# Altium schematic sheet Sheet1.SchDoc
size 209 x 297 mm; SheetNumber: 1; SheetTotal: 1
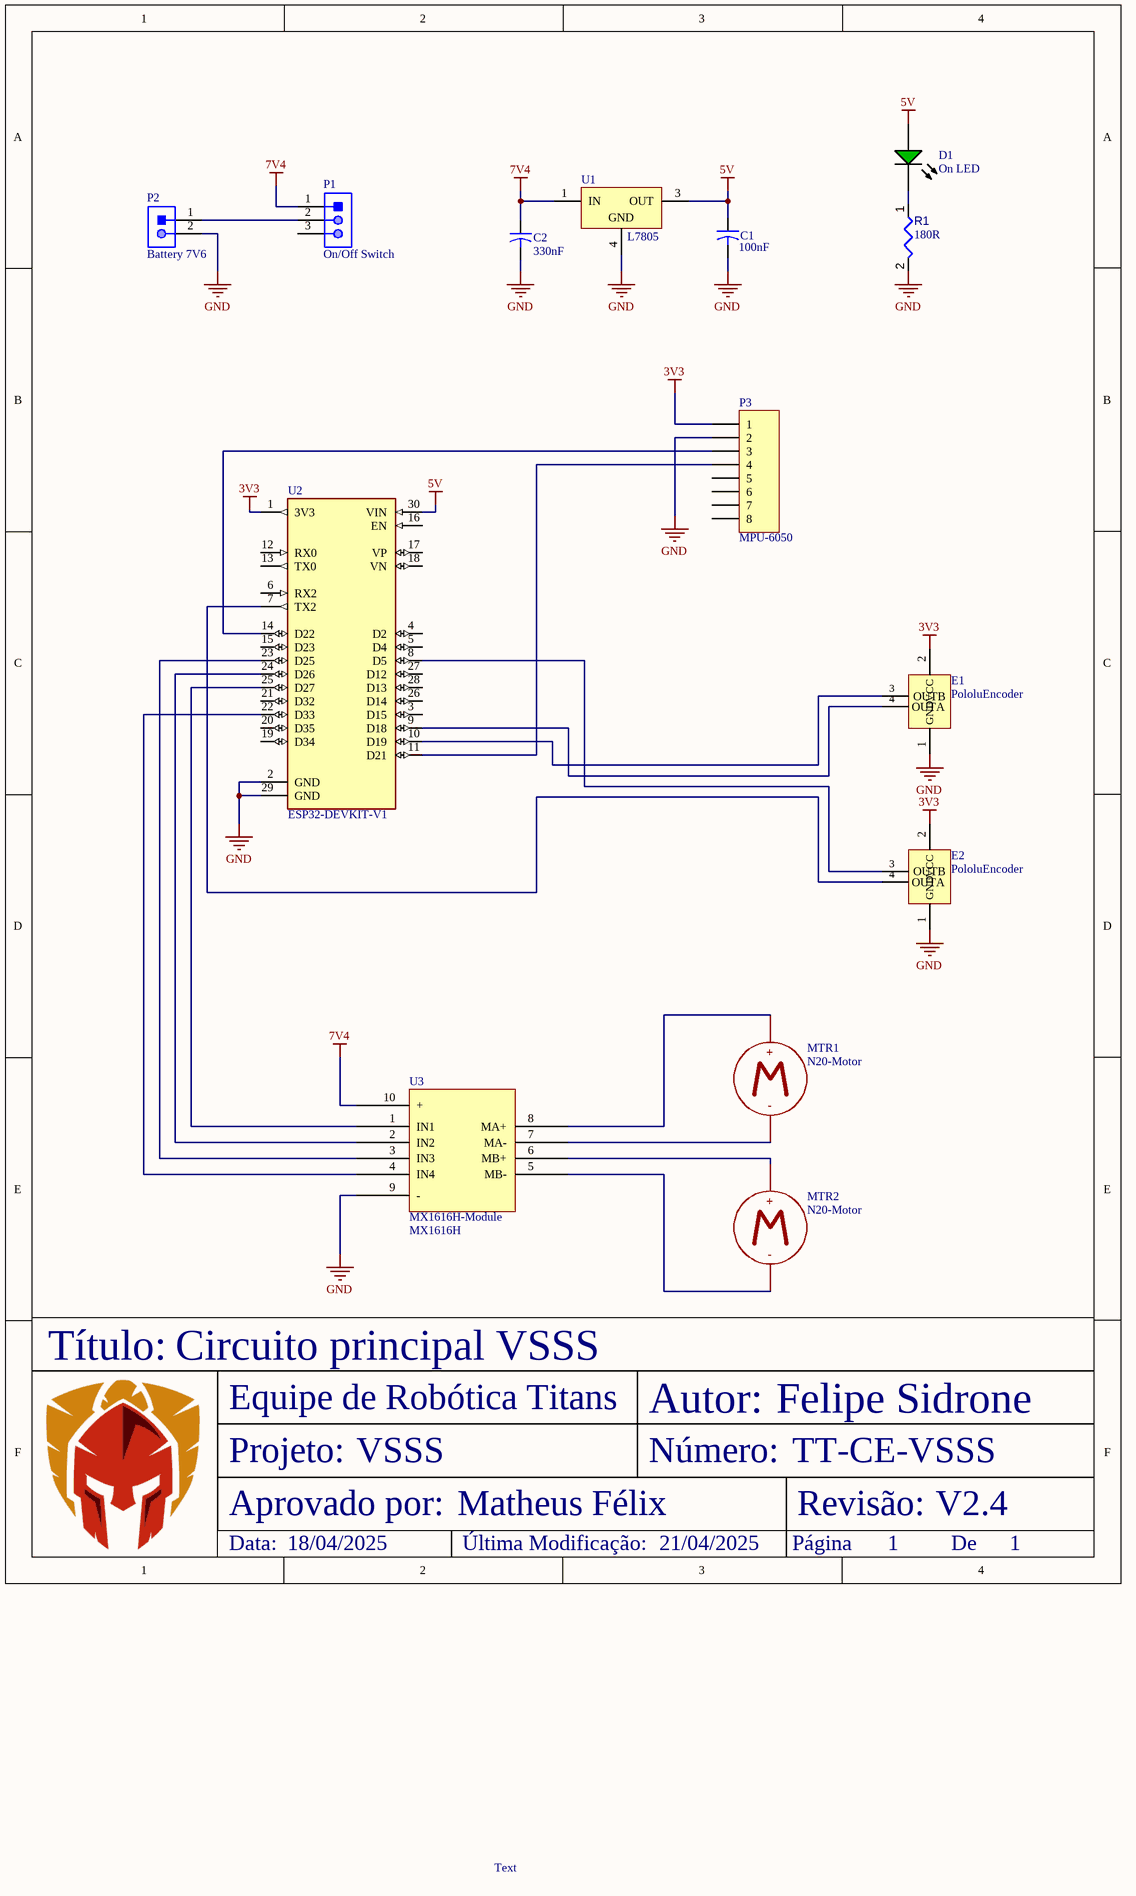
[diagram p0: Sheet1.SchDoc]

## Parts
C1  value 100nF  [CAPR5-4X5]  (hidden comment: Cap2)
C2  value 330nF  [CAPR5-4X5]  (hidden comment: Cap2)
D1  On LED  [LTST-LTL-1CHG-2]
E1  PololuEncoder  [PololuEncoder]
E2  PololuEncoder  [PololuEncoder]
MTR1  N20-Motor  [N20-Motor_Encaixe]
MTR2  N20-Motor  [N20-Motor_Encaixe]
P1  On/Off Switch  [JST-B3P-VH(LF)(SN)-3_V]
P2  Battery 7V6  [JST-B2P-VH(LF)(SN)_V]
P3  MPU-6050  [HDR1X8]
R1  value 180R  [RESA60-630X240]  (hidden comment: MFR-25FBF52-4K75)
U1  L7805  [TO-263_L]
U2  ESP32-DEVKIT-V1  [ESP32DEVKIT]
U3  MX1616H-Module  Supplier Part Number: MX1616H  [MX1616H-Module]

## Nets
3V3: E1.2(VCC) E2.2(VCC) P3.1 U2.1(3V3)
5V: C1.1 D1.1(A) U1.3(OUT) U2.30(VIN)
7V4: C2.1 P1.1 U1.1(IN) U3.10(+)
GND: C1.2 C2.2 E1.1(GND) E2.1(GND) P2.2 P3.2 R1.2 U1.4(GND) U2.2(GND) U2.29(GND) U3.9(-)
NetD1_2: D1.2(K) R1.1
NetE1_3: E1.3(OUTB) U2.10(D19)
NetE1_4: E1.4(OUTA) U2.9(D18)
NetE2_3: E2.3(OUTB) U2.8(D5)
NetE2_4: E2.4(OUTA) U2.7(TX2)
NetMTR1_1: MTR1.1 U3.8(MA+)
NetMTR1_2: MTR1.2 U3.7(MA-)
NetMTR2_1: MTR2.1 U3.6(MB+)
NetMTR2_2: MTR2.2 U3.5(MB-)
NetP1_2: P1.2 P2.1
NetP3_3: P3.3 U2.14(D22)
NetP3_4: P3.4 U2.11(D21)
NetU2_22: U2.22(D33) U3.4(IN4)
NetU2_23: U2.23(D25) U3.3(IN3)
NetU2_24: U2.24(D26) U3.2(IN2)
NetU2_25: U2.25(D27) U3.1(IN1)

Not connected (* = marked no-connect by the designer): P1 3; P3 5 6 7 8; U2 3(D15) 4(D2) 5(D4) 6(RX2) 12(RX0) 13(TX0) 15(D23) 16(EN) 17(VP) 18(VN) 19(D34) 20(D35) 21(D32) 26(D14) 27(D12) 28(D13)

## Notes on the sheet
- Circuito principal VSSS
- VSSS
- Felipe Sidrone
- TT-CE-VSSS
- Matheus Félix
- V2.4
- 18/04/2025
- 21/04/2025
- 1
- Text
- Título:
- Equipe de Robótica Titans
- Projeto:
- Autor:
- Número:
- Aprovado por:
- Revisão:
- Data:
- Última Modificação:
- Página
- De
- (in symbol N20-Motor) +; -

## Library data of the parts
C1 C2 = CMP-001-00090-1: Capacitor; Signal Integrity: Cap; Case/Package: Capacitor; 2 Leads; Component Type: Standard; Design Item ID: Cap2; Source: Miscellaneous Devices.SchLib; Publisher: Altium Limited; Pins: 2; PackageReference: CAPR5-4X5; Published: 23-Sep-2002
D1 = CMP-007-00019-2: LED Uni-Color Green, 100 mW, 30 mA, -55 to 100 degC, 2-Pin THD, RoHS, Bulk; Manufacturer: Lite-On; Power: 100mW; Forward Voltage: 2.6V; Forward Current: 30mA; Nominal Vf: 2.1V; Lens Style: Dome; Viewing Angle: 60degrees; Luminous Intensity: 12.6mcd; Max Operating Temperature: 100°C; Case/Package: Radial; Package Reference: LTL-1CHG; Manufacturer URL: http://www.us.liteon.com/; Package Quantity: 1000; Colour: Green; Packaging: Bulk; RoHS Compliant: True; Datasheet URL: http://datasheet.octopart.com/LTL-1CHG-Lite-On-datasheet-143841.pdf; Package Description: 2-Pin Through Hole Device, Dia 3.8 mm; Min Operating Temperature: -55°C; Mounting Technology: TH; Pins: 2; Illumination Colour: Green; Datasheet Version: Mar-00
E1 E2 = PololuEncoder: Pololu Optical Quadrature Encoder
P1 = CMP-002-00026-2: Male Header, Pitch 3.96 mm, 1 x 3 Position, Height 10.9 mm, Tail Length 3.7 mm, -25 to 85 degC, RoHS, Bulk; Manufacturer: JST; Case/Package: B3P-VH(LF)(SN); Connector Type: Header; Datasheet Version: May-16; Mounting Technology: TH; Package Description: Male Header, Pitch 3.96 mm, 1 x 3 Position, Height 10.9 mm, Tail Length 3.7 mm; Gender: Male; Manufacturer URL: http://www.jst.com/home2.html; Package Reference: B3P-VH(LF)(SN); Datasheet URL: http://www.jst-mfg.com/product/pdf/eng/eVH.pdf; Min Operating Temperature: -25°C; Max Operating Temperature: 85°C; RoHS Compliant: Unknown
P2 = CMP-002-00025-2: Male Header, Pitch 3.96 mm, 1 x 2 Position, Height 10.9 mm, Tail Length 3.7 mm, -25 to 85 degC, RoHS, Bulk; Manufacturer: JST; Case/Package: B2P-VH(LF)(SN); Connector Type: Header; Mounting Technology: TH; Package Reference: B2P-VH(LF)(SN); Package Description: Male Header, Pitch 3.96 mm, 1 x 2 Position, Height 10.9 mm, Tail Length 3.7 mm; Max Operating Temperature: 85°C; Manufacturer URL: http://www.jst.com/home2.html; RoHS Compliant: Unknown; Datasheet Version: May-16; Gender: Male; Min Operating Temperature: -25°C; Datasheet URL: http://www.jst-mfg.com/product/pdf/eng/eVH.pdf
P3 = Header 8: Header, 8-Pin; LatestRevisionDate: 17-Jul-2002; LatestRevisionNote: Re-released for DXP Platform.; Publisher: Altium Limited
R1 = CMP-009-00059-4: Axial Resistor, 4.75 KOhm, +/- 1%, 0.25 W, -55 to 155 degC, 2-Pin THD, RoHS, Bulk; Manufacturer: Yageo; Voltage Rating: 250V; Power: 250mW; Datasheet Version: Apr-13; Mounting Technology: TH; Package Reference: MFR-25; RoHS Compliant: True; Composition: MetalFilm; Datasheet URL: http://www.yageo.com/documents/recent/Yageo%20LR_MFR_2013.pdf; Max Operating Temperature: 155°C; Package Quantity: 200; Case/Package: Axial; Package Description: 2-Pin Axial Lead, Dia 2.4 mm, Body Length 6.3 mm; Tolerance: 1%; Packaging: Bulk; Manufacturer URL: http://www.yageo.com/; Min Operating Temperature: -55°C
U1 = CMP-0244-00213-1: Positive Voltage Regulator, 3-Pin D2PAK, Tape and Reel; PackageReference: TO-263; ComponentLink2URL: http://www.st.com/internet/com/TECHNICAL_RESOURCES/TECHNICAL_LITERATURE/DATASHEET/CD00000444.pdf; PackageDescription: 3-Pin Transistor Outline Package 2.54 mm Pitch, 15.4 mm Lead Span (D2PAK); DatasheetVersion: 16/11/2011; ComponentLink2Description: Datasheet; ComponentLink1Description: Manufacturer URL; PackageVersion: 2011; ComponentLink1URL: http://www.st.com
U2 = ESP32-DEVKIT-V1: Dual core, Wi-Fi: 2.4 GHz up to 150 Mbits/s,BLE (Bluetooth Low Energy) and legacy Bluetooth, 32 bits, Up to 240 MHz; MF: Do it; Price: None; Availability: Not in stock; Package: None; MP: ESP32-DEVKIT-V1; Value: *; SnapEDA_Link: https://www.snapeda.com/parts/ESP32-DEVKIT-V1/Do+it/view-part/?ref=snap; Check_prices: https://www.snapeda.com/parts/ESP32-DEVKIT-V1/Do+it/view-part/?ref=eda
U3 = MX1616H-Module: Full Bridge Based Peripheral Driver; Manufacturer: STMicroelectronics; Manufacturer Part Number: L298N; Channels: 2; Surface Mount: No; Built-in Protections: Over Current; Output Polarity: True; Input Characteristics: STANDARD; Output Characteristics: TOTEM-POLE; Output Current Flow Direction: SOURCE AND SINK; Supply Voltage1-Max: 46V; Supply Voltage1-Min: 4.8V; Supply Voltage1-Nom: 42V; Max Supply Voltage: 7V; Min Supply Voltage: 4.5V; Nominal Supply Voltage: 5V; Qualification Status: Not Qualified; Supplier: Mouser; RoHS: Yes; Category: Motor Drivers; Stock: 19; Pricing: 1=11,87, 10=10,91, 25=10,14, 50=10,14, 100=8,76, 250=8,44, 500=7,89, 1000=7,89, 10000=7,89 (USD); Pins: 15; Package Shape: Rectangular; Terminal Finish: Tin; JESD-609 Code: e3; Package Style: FLANGE MOUNTMeter; Terminal Form: Through Hole; Terminal Position: ZIG-ZAG; Interface IC Type: FULL BRIDGE BASED PERIPHERAL DRIVER; RoHS Compliant: Yes; Reach SVHC Compliant: No; ComponentLink1URL: https://datasheet.ciiva.com:443/pdfs/VipMasterIC/IC/SGST/SGSTS36572/SGSTS36572-1.pdf?src-supplier=IHS+Markit; ComponentLink1Description: https://datasheet.ciiva.com:443/pdfs/VipMasterIC/IC/SGST/SGSTS36572/SGSTS36572-1.pdf?src-supplier=IHS+Markit; ComponentLink2URL: https://datasheet.ciiva.com/14150/ofl298n-647108-dat-en-14150301.pdf?src-supplier=Distrelec; ComponentLink2Description: https://datasheet.ciiva.com/14150/ofl298n-647108-dat-en-14150301.pdf?src-supplier=Distrelec; ComponentLink3URL: https://datasheet.ciiva.com/19456/245403-19456698.pdf?src-supplier=Jameco; ComponentLink3Description: https://datasheet.ciiva.com/19456/245403-19456698.pdf?src-supplier=Jameco; ComponentLink4URL: https://datasheet.ciiva.com/15109/getdatasheetpartid-50682-15109332.pdf?src-supplier=Verical; ComponentLink4Description: https://datasheet.ciiva.com/15109/getdatasheetpartid-50682-15109332.pdf?src-supplier=Verical; ComponentLink5URL: https://datasheet.ciiva.com/25626/0900766b80060c26-25626619.pdf?src-supplier=Rs; ComponentLink5Description: https://datasheet.ciiva.com/25626/0900766b80060c26-25626619.pdf?src-supplier=Rs; ComponentLink6URL: https://datasheet.ciiva.com/29306/156128-da-01-en-dual-bridge-driv-l298n-29306997.pdf?src-supplier=Conrad; ComponentLink6Description: https://datasheet.ciiva.com/29306/156128-da-01-en-dual-bridge-driv-l298n-29306997.pdf?src-supplier=Conrad; ComponentLink7URL: https://datasheet.ciiva.com/1501/1693054-1501547.pdf?src-supplier=Element14; ComponentLink7Description: https://datasheet.ciiva.com/1501/1693054-1501547.pdf?src-supplier=Element14; ComponentLink8URL: https://datasheet.ciiva.com/1608/1693054-1608165.pdf?src-supplier=Newark; ComponentLink8Description: https://datasheet.ciiva.com/1608/1693054-1608165.pdf?src-supplier=Newark; ComponentLink9URL: https://datasheet.ciiva.com/1500/1693054-1500714.pdf?src-supplier=Element14; ComponentLink9Description: https://datasheet.ciiva.com/1500/1693054-1500714.pdf?src-supplier=Element14; ComponentLink10URL: https://datasheet.ciiva.com/1955/cd00000240-1955436.pdf?src-supplier=Digi-Key; ComponentLink10Description: https://datasheet.ciiva.com/1955/cd00000240-1955436.pdf?src-supplier=Digi-Key; ComponentLink11URL: https://datasheet.ciiva.com/4895/cd00000240-4895919.pdf?src-supplier=Mouser; ComponentLink11Description: https://datasheet.ciiva.com/4895/cd00000240-4895919.pdf?src-supplier=Mouser